# EAGLE schematic untitled (EAGLE 7.2.0)
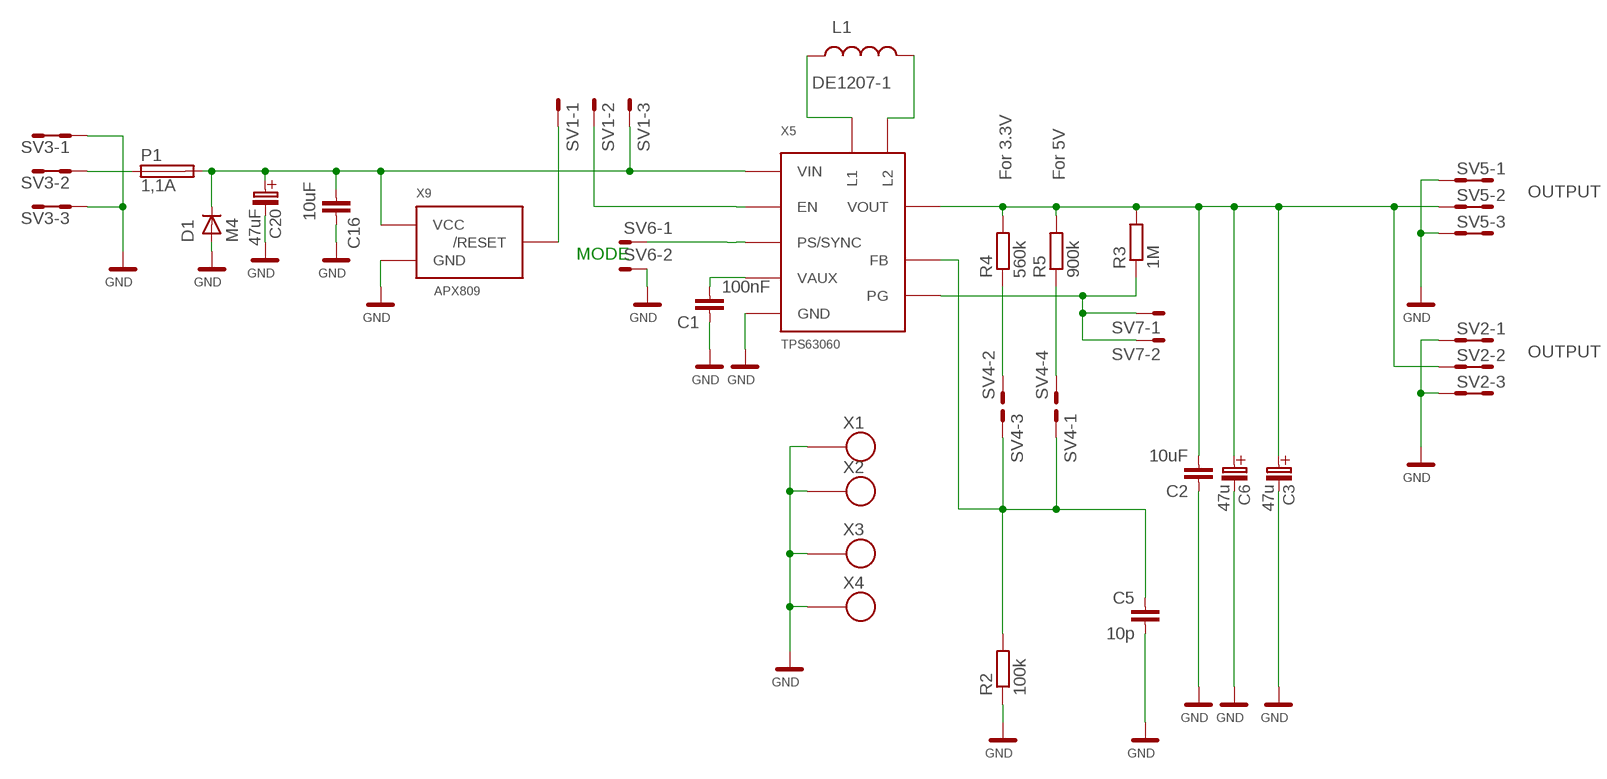
[diagram p0: schematic, sheet 1]

## Parts
C1  100nF  C0805  [C0805]
C2  10uF  C0805  [C0805]
C3  47u  C  [C]
C5  10p  C0805  [C0805]
C6  47u  C  [C]
C16  10uF  C0805  [C0805]
C20  47uF  C  [C]
D1  M4  D-OB.SMA  [SMA]
L1  DE1207-1  DE1205-10  [DE1205-10]
P1  1,1A  POJISTKA_1812  [1812]
R2  100k  R0805  [0805]
R3  1M  R0805  [0805]
R4  560k  R0805  [0805]
R5  900k  R0805  [0805]
SV1  MA03-1  [MA03-1]
SV2  MA03-2  [MA03-2]
SV3  MA03-2  [MA03-2]
SV4  MA02-3  [MA02-2]
SV5  MA03-2  [MA03-2]
SV6  MA02-1  [MA02-1]
SV7  MA02-1  [MA02-1]
X1  SROUB3M  [SROUB3M]
X2  SROUB3M  [SROUB3M]
X3  SROUB3M  [SROUB3M]
X4  SROUB3M  [SROUB3M]
X5  TPS63060  [SON10]
X9  APX809  APX809-26SA  [SOT23]

## Nets
+BAT2: C16.2 C20.+(C_EL+) D1.K(C) P1.2 SV1.3 X5.2(VIN) X9.3(VCC)
GND: C1.1 C2.1 C3.-(C_EL-) C5.2 C6.-(C_EL-) C16.1 C20.-(C_EL-) D1.A R2.1 SV2.1 SV2.2 SV2.5 SV2.6 SV3.1 SV3.2 SV3.5 SV3.6 SV5.1 SV5.2 SV5.5 SV5.6 SV6.2 X1.P$1 X2.P$1 X3.P$1 X4.P$1 X5.7(GND) X5.11(GND) X5.12(GND) X5.13(GND) X5.14(GND) X5.15(GND) X5.16(GND) X5.17(GND) X5.18(GND) X5.19(GND) X5.21(GND) X5.P$1(GND) X5.P$2(GND) X5.P$3(GND) X5.P$4(GND) X5.P$5(GND) X9.1(GND)
N$1: SV1.1 X9.2(/RESET)
N$3: SV1.2 X5.3(EN)
N$4: P1.1 SV3.3 SV3.4
N$5: C5.1 R2.2 SV4.1 SV4.3 X5.8(FB)
N$6: R3.1 SV7.1 SV7.2 X5.5(PG)
N$7: R4.1 SV4.2
N$8: C2.2 C3.+(C_EL+) C6.+(C_EL+) R3.2 R4.2 R5.2 SV2.3 SV2.4 SV5.3 SV5.4 X5.9(VOUT)
N$9: R5.1 SV4.4
N$13: SV6.1 X5.4(PS/SYNC)
N$14: C1.2 X5.6(VAUX)
N$15: L1.P$1 X5.1(L1)
N$16: L1.P$2 X5.10(L2)

## Notes on the sheet
- For 3.3V | For 5V
- OUTPUT
- MODE
- OUTPUT

## Library data of the parts
C1 C2 C5 C16 = moje_C:C0805
C3 C6 C20 = moje_C:C
D1 = moje:D-OB.SMA: SMA
L1 = moje_L:DE1205-10: tlumivka
P1 = moje:POJISTKA_1812: Pojistka s pouzdrem 1812
R2-R5 = moje_R:R0805
SV1 = moje_hrebinky:MA03-1: PIN HEADER; OC_FARNELL: unknown; OC_NEWARK: unknown
SV2 SV3 SV5 = moje_hrebinky:MA03-2: PIN HEADER; OC_FARNELL: unknown; OC_NEWARK: unknown
SV4 = moje_hrebinky:MA02-3
SV6 SV7 = moje_hrebinky:MA02-1
X1-X4 = moje:SROUB3M
X5 = moje_io:TPS63060: SON10 - měnič TPS63060
X9 = moje_io:APX809-26SA